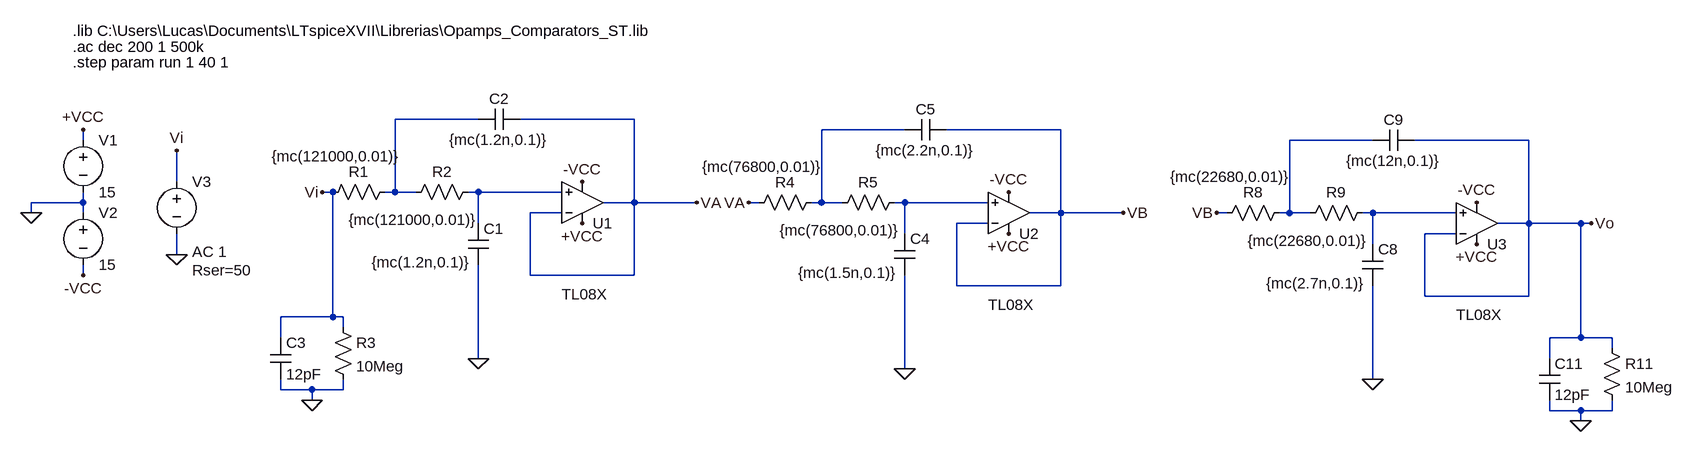
[diagram p0: schematic ConexionCascadaBessel.asc]
ConexionCascadaBessel.asc, the LTspice schematic file:
Version 4
SHEET 1 2720 680
WIRE 240 -48 112 -48
WIRE 480 -48 304 -48
WIRE 896 -32 768 -32
WIRE 1136 -32 960 -32
WIRE -368 -16 -368 -32
WIRE 1616 -16 1488 -16
WIRE 1856 -16 1680 -16
WIRE -224 48 -224 0
WIRE 16 64 0 64
WIRE 112 64 112 -48
WIRE 112 64 96 64
WIRE 144 64 112 64
WIRE 240 64 224 64
WIRE 368 64 240 64
WIRE -368 80 -368 64
WIRE -368 80 -448 80
WIRE 480 80 480 -48
WIRE 480 80 432 80
WIRE 576 80 480 80
WIRE 672 80 656 80
WIRE 768 80 768 -32
WIRE 768 80 752 80
WIRE 800 80 768 80
WIRE 896 80 880 80
WIRE 1024 80 896 80
WIRE -448 96 -448 80
WIRE -368 96 -368 80
WIRE 368 96 320 96
WIRE 1136 96 1136 -32
WIRE 1136 96 1088 96
WIRE 1232 96 1136 96
WIRE 1392 96 1376 96
WIRE 1488 96 1488 -16
WIRE 1488 96 1472 96
WIRE 1520 96 1488 96
WIRE 1616 96 1600 96
WIRE 1744 96 1616 96
WIRE 240 112 240 64
WIRE 1024 112 976 112
WIRE 1856 112 1856 -16
WIRE 1856 112 1808 112
WIRE 1936 112 1856 112
WIRE 1952 112 1936 112
WIRE 896 128 896 80
WIRE 1744 128 1696 128
WIRE 1616 144 1616 96
WIRE -224 160 -224 128
WIRE -368 192 -368 176
WIRE 320 192 320 96
WIRE 480 192 480 80
WIRE 480 192 320 192
WIRE 976 208 976 112
WIRE 1136 208 1136 96
WIRE 1136 208 976 208
WIRE 1696 224 1696 128
WIRE 1856 224 1856 112
WIRE 1856 224 1696 224
WIRE 16 256 16 64
WIRE 16 256 -64 256
WIRE 32 256 16 256
WIRE 32 272 32 256
WIRE -64 288 -64 256
WIRE 1936 288 1936 112
WIRE 1936 288 1888 288
WIRE 1984 288 1936 288
WIRE 1984 304 1984 288
WIRE 240 320 240 176
WIRE 1888 320 1888 288
WIRE 896 336 896 192
WIRE 1616 352 1616 208
WIRE -64 368 -64 352
WIRE -16 368 -64 368
WIRE 32 368 32 352
WIRE 32 368 -16 368
WIRE -16 384 -16 368
WIRE 1888 400 1888 384
WIRE 1936 400 1888 400
WIRE 1984 400 1984 384
WIRE 1984 400 1936 400
WIRE 1936 416 1936 400
FLAG -448 96 0
FLAG -368 -32 +VCC
FLAG -368 192 -VCC
FLAG -224 160 0
FLAG -224 0 Vi
FLAG 1056 128 +VCC
FLAG 1056 64 -VCC
FLAG 896 336 0
FLAG 1232 96 VB
FLAG 656 80 VA
FLAG 1776 144 +VCC
FLAG 1776 80 -VCC
FLAG 1616 352 0
FLAG 1952 112 Vo
FLAG 1376 96 VB
FLAG 1936 416 0
FLAG 400 112 +VCC
FLAG 400 48 -VCC
FLAG 240 320 0
FLAG 576 80 VA
FLAG 0 64 Vi
FLAG -16 384 0
SYMBOL voltage -368 -32 R0
WINDOW 123 0 0 Left 0
WINDOW 39 0 0 Left 0
SYMATTR InstName V1
SYMATTR Value 15
SYMBOL voltage -368 80 R0
WINDOW 123 0 0 Left 0
WINDOW 39 0 0 Left 0
SYMATTR InstName V2
SYMATTR Value 15
SYMBOL voltage -224 32 R0
WINDOW 123 24 124 Left 2
WINDOW 39 24 152 Left 2
SYMATTR Value2 AC 1
SYMATTR SpiceLine Rser=50
SYMATTR InstName V3
SYMATTR Value ""
SYMBOL Opamps\\opamp2 1056 160 M180
WINDOW 3 -32 -77 Left 2
SYMATTR Value TL08X
SYMATTR InstName U2
SYMBOL res 768 64 R90
WINDOW 0 0 56 VBottom 2
WINDOW 3 -55 90 VTop 2
SYMATTR InstName R4
SYMATTR Value {mc(76800,0.01)}
SYMBOL res 896 64 R90
WINDOW 0 0 56 VBottom 2
WINDOW 3 43 99 VTop 2
SYMATTR InstName R5
SYMATTR Value {mc(76800,0.01)}
SYMBOL cap 880 128 R0
WINDOW 3 -148 60 Left 2
SYMATTR Value {mc(1.5n,0.1)}
SYMATTR InstName C4
SYMBOL cap 960 -48 R90
WINDOW 0 0 32 VBottom 2
WINDOW 3 32 32 VTop 2
SYMATTR InstName C5
SYMATTR Value {mc(2.2n,0.1)}
SYMBOL Opamps\\opamp2 1776 176 M180
WINDOW 3 -32 -77 Left 2
SYMATTR Value TL08X
SYMATTR InstName U3
SYMBOL res 1488 80 R90
WINDOW 0 0 56 VBottom 2
WINDOW 3 -55 90 VTop 2
SYMATTR InstName R8
SYMATTR Value {mc(22680,0.01)}
SYMBOL res 1616 80 R90
WINDOW 0 0 56 VBottom 2
WINDOW 3 43 99 VTop 2
SYMATTR InstName R9
SYMATTR Value {mc(22680,0.01)}
SYMBOL cap 1600 144 R0
WINDOW 3 -148 60 Left 2
SYMATTR Value {mc(2.7n,0.1)}
SYMATTR InstName C8
SYMBOL cap 1680 -32 R90
WINDOW 0 0 32 VBottom 2
WINDOW 3 32 32 VTop 2
SYMATTR InstName C9
SYMATTR Value {mc(12n,0.1)}
SYMBOL cap 1872 320 R0
SYMATTR InstName C11
SYMATTR Value 12pF
SYMBOL res 1968 288 R0
SYMATTR InstName R11
SYMATTR Value 10Meg
SYMBOL Opamps\\opamp2 400 144 M180
WINDOW 3 -32 -77 Left 2
SYMATTR Value TL08X
SYMATTR InstName U1
SYMBOL res 112 48 R90
WINDOW 0 0 56 VBottom 2
WINDOW 3 -55 90 VTop 2
SYMATTR InstName R1
SYMATTR Value {mc(121000,0.01)}
SYMBOL res 240 48 R90
WINDOW 0 0 56 VBottom 2
WINDOW 3 43 99 VTop 2
SYMATTR InstName R2
SYMATTR Value {mc(121000,0.01)}
SYMBOL cap 224 112 R0
WINDOW 3 -148 60 Left 2
SYMATTR Value {mc(1.2n,0.1)}
SYMATTR InstName C1
SYMBOL cap 304 -64 R90
WINDOW 0 0 32 VBottom 2
WINDOW 3 32 32 VTop 2
SYMATTR InstName C2
SYMATTR Value {mc(1.2n,0.1)}
SYMBOL cap -80 288 R0
SYMATTR InstName C3
SYMATTR Value 12pF
SYMBOL res 16 256 R0
SYMATTR InstName R3
SYMATTR Value 10Meg
TEXT -384 -184 Left 2 !.lib C:\\Users\\Lucas\\Documents\\LTspiceXVII\\Librerias\\Opamps_Comparators_ST.lib
TEXT -384 -160 Left 2 !.ac dec 200 1 500k
TEXT -384 -136 Left 2 !.step param run 1 40 1

The netlist it stands for:
* ConexionCascadaBessel.asc
V1 +VCC 0 15
V2 0 -VCC 15
V3 Vi 0 AC 1 Rser=50
XU2 N005 VB +VCC -VCC VB TL08X  ; pins In+ In- V+ V- OUT
R4 N002 VA {mc(76800,0.01)}
R5 N005 N002 {mc(76800,0.01)}
C4 N005 0 {mc(1.5n,0.1)}
C5 VB N002 {mc(2.2n,0.1)}
XU3 N006 Vo +VCC -VCC Vo TL08X  ; pins In+ In- V+ V- OUT
R8 N003 VB {mc(22680,0.01)}
R9 N006 N003 {mc(22680,0.01)}
C8 N006 0 {mc(2.7n,0.1)}
C9 Vo N003 {mc(12n,0.1)}
C11 Vo 0 12pF
R11 Vo 0 10Meg
XU1 N004 VA +VCC -VCC VA TL08X  ; pins In+ In- V+ V- OUT
R1 N001 Vi {mc(121000,0.01)}
R2 N004 N001 {mc(121000,0.01)}
C1 N004 0 {mc(1.2n,0.1)}
C2 VA N001 {mc(1.2n,0.1)}
C3 Vi 0 12pF
R3 Vi 0 10Meg
.lib C:\Users\Lucas\Documents\LTspiceXVII\Librerias\Opamps_Comparators_ST.lib
.ac dec 200 1 500k
.step param run 1 40 1
.backanno
.end